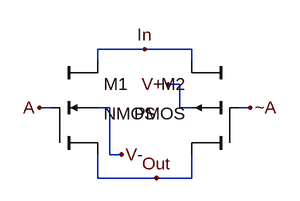
[diagram p0: schematic PassGate.asc]
PassGate.asc, the LTspice schematic file:
Version 4
SHEET 1 880 680
WIRE 256 128 192 128
WIRE 320 128 256 128
WIRE 192 144 192 128
WIRE 320 144 320 128
WIRE 304 176 288 176
WIRE 128 208 112 208
WIRE 208 208 192 208
WIRE 304 208 304 176
WIRE 320 208 304 208
WIRE 400 208 384 208
WIRE 208 272 208 208
WIRE 224 272 208 272
WIRE 192 304 192 272
WIRE 272 304 192 304
WIRE 320 304 320 272
WIRE 320 304 272 304
FLAG 224 272 V-
FLAG 288 176 V+
FLAG 256 128 In
FLAG 272 304 Out
FLAG 112 208 A
FLAG 400 208 ~A
SYMBOL cktsym\\nmos4 192 208 R0
SYMATTR InstName M1
SYMATTR Value2 l=0.6um w=1.8um
SYMBOL cktsym\\pmos4 320 208 M0
SYMATTR InstName M2
SYMATTR Value2 l=0.6um w=1.8um

The netlist it stands for:
* PassGate.asc
M1 In A Out V- NMOS l=0.6um w=1.8um
M2 Out ~A In V+ PMOS l=0.6um w=1.8um
.model NMOS NMOS
.model PMOS PMOS
.lib standard.mos
.backanno
.end